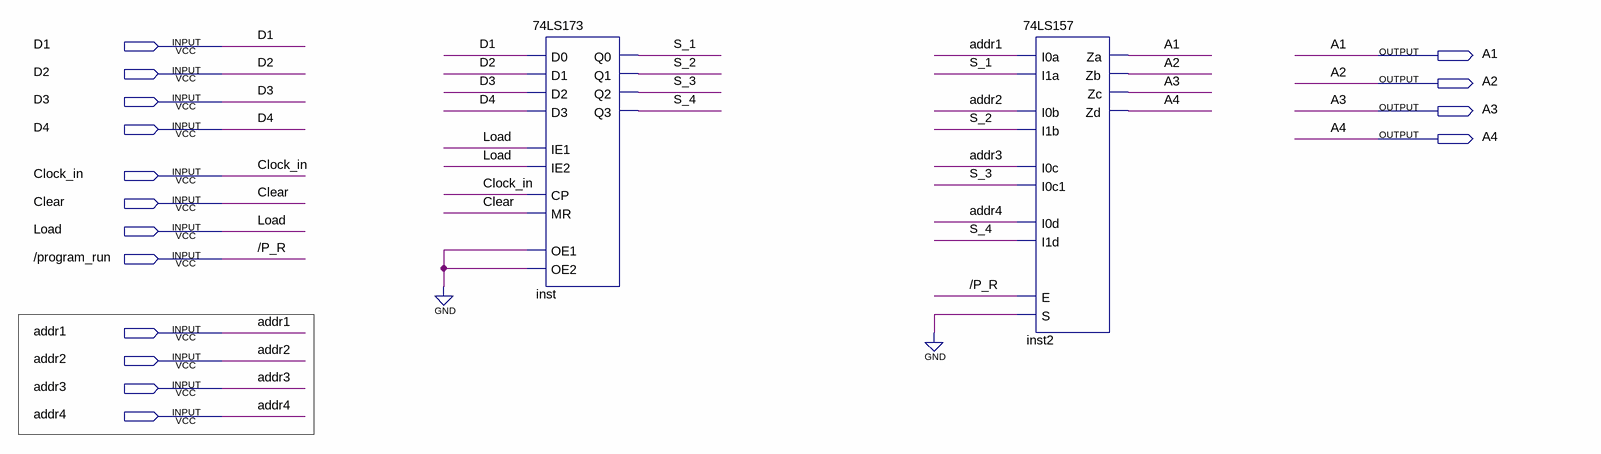
[diagram p0: schematic sheet]
// Quartus schematic Mar.bdf as structural Verilog: 2 symbols, 16 pins
module Mar (
  input  D1,
  input  D2,
  input  D3,
  input  D4,
  input  Clock_in,
  input  Clear,
  input  Load,
  input  \/program_run ,
  input  addr1,
  input  addr2,
  input  addr3,
  input  addr4,
  output A1,
  output A2,
  output A3,
  output A4
);

  wire S_1, S_2, S_3, S_4;

  \74LS173  inst (
    .D0(D1), .D3(D4), .D1(D2), .D2(D3), .IE1(Load), .IE2(Load), .CP(Clock_in), .MR(Clear), .OE1(1'b0),
    .OE2(1'b0), .Q0(S_1), .Q1(S_2), .Q2(S_3), .Q3(S_4));
  \74LS157  inst2 (
    .I0a(addr1), .I1a(S_1), .I0b(addr2), .I1b(S_2), .I0c(addr3), .I0c1(S_3), .I0d(addr4), .I1d(S_4),
    .E(\/program_run ), .S(1'b0), .Za(A1), .Zb(A2), .Zc(A3), .Zd(A4));

  // Other names for the same wires on the sheet: /P_R = \/program_run 
endmodule
